# EAGLE schematic pCog102_Wifi_PSPJoy_BLED_TFT (EAGLE 6.6.0)

## Sheet 1 of 4
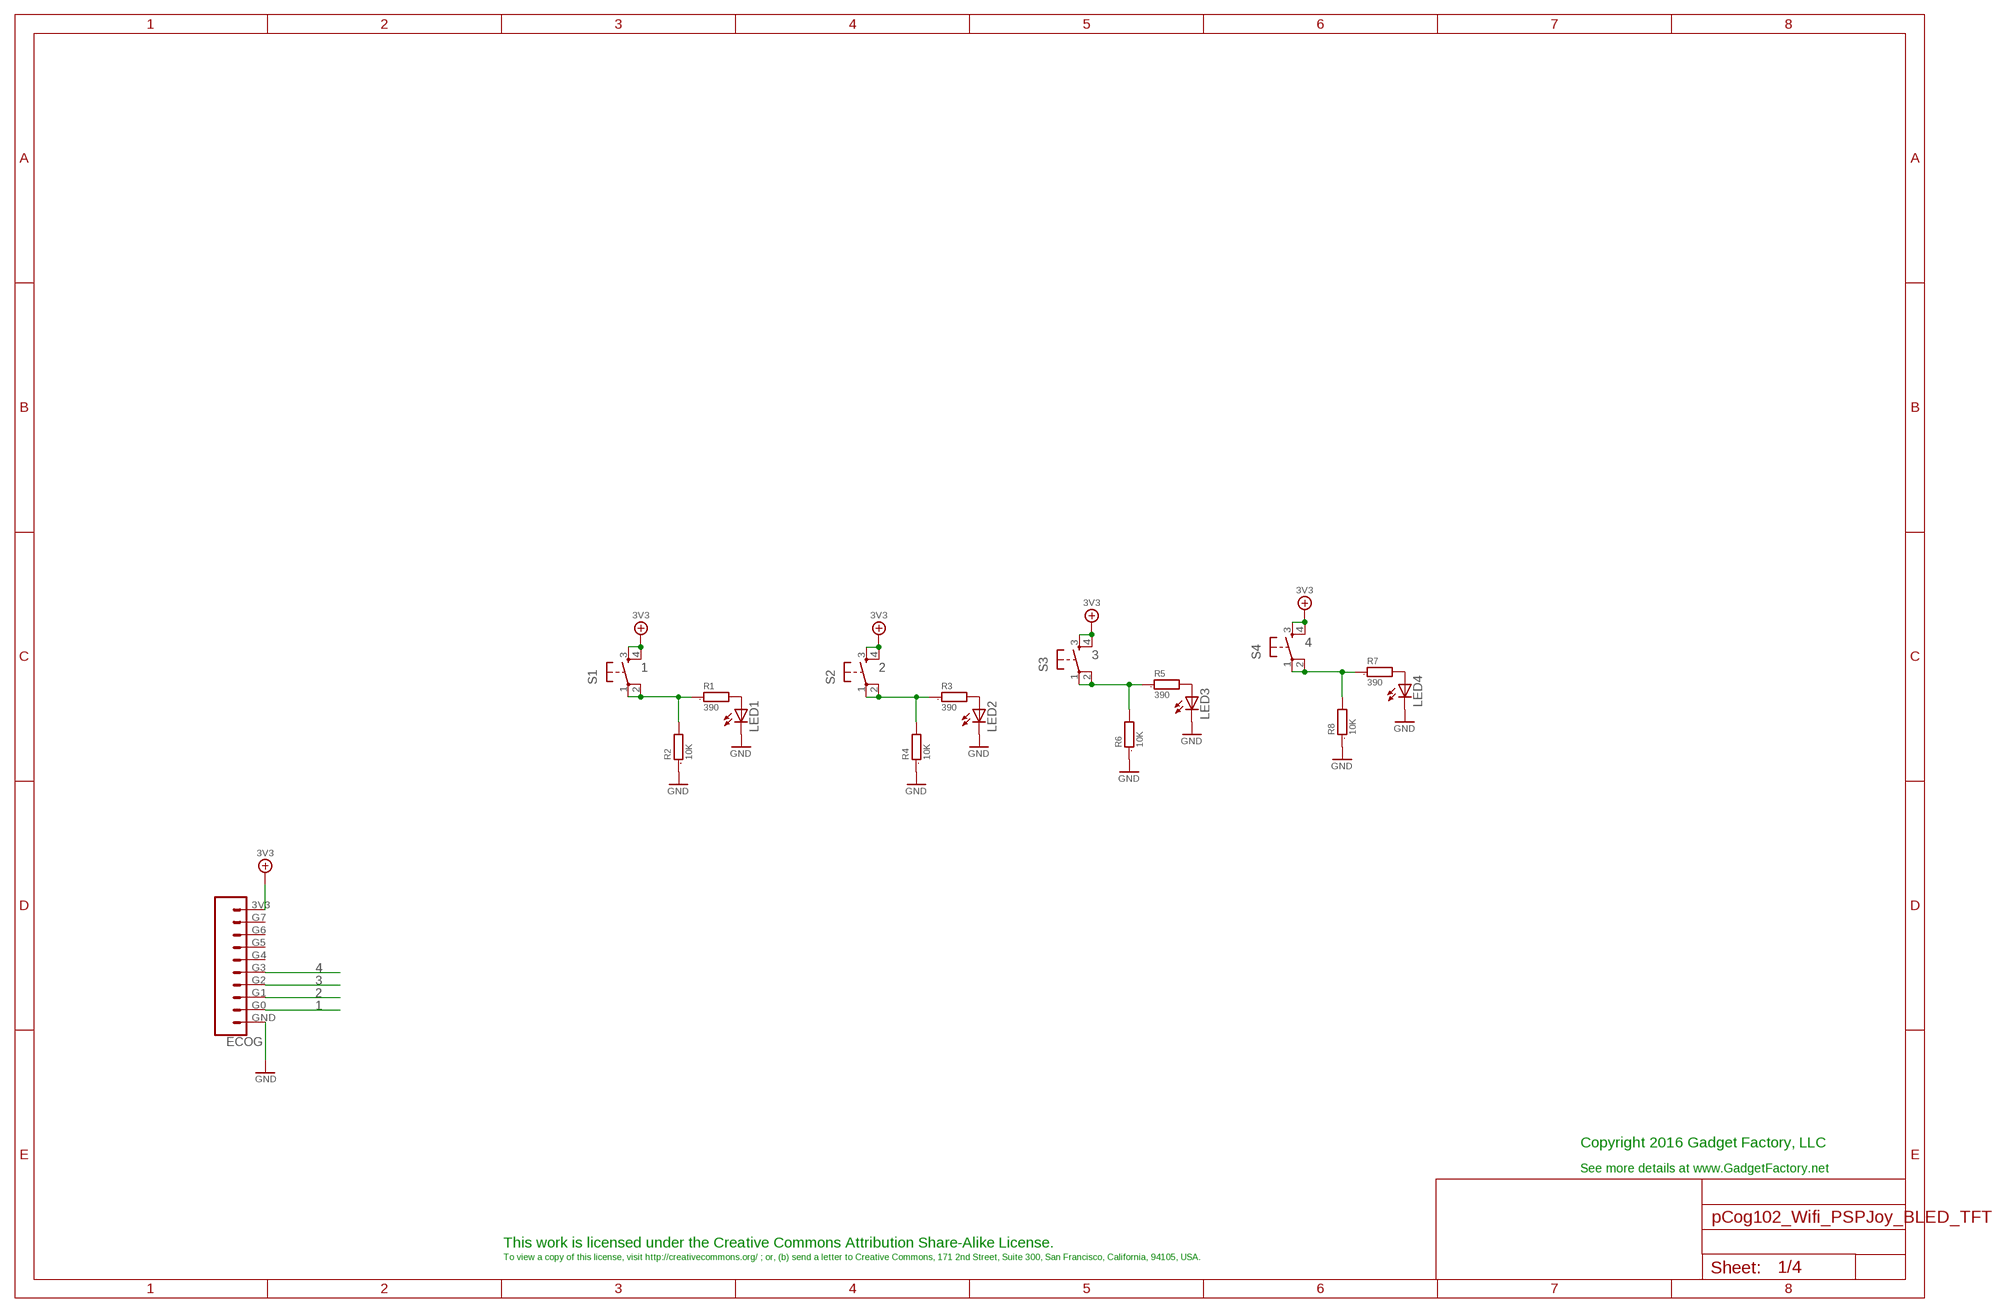
[diagram p0: schematic, sheet 1]

### Parts
ECOG  ECOG_GENERAL_ROWECOG_GENERAL_SMD  [ECOG_GENERAL_SMD]
LED1  LEDCHIP-LED0805  [CHIP-LED0805]
LED2  LEDCHIP-LED0805  [CHIP-LED0805]
LED3  LEDCHIP-LED0805  [CHIP-LED0805]
LED4  LEDCHIP-LED0805  [CHIP-LED0805]
R1  390  R0805  [0805]
R2  10K  R0805  [0805]
R3  390  R0805  [0805]
R4  10K  R0805  [0805]
R5  390  R0805  [0805]
R6  10K  R0805  [0805]
R7  390  R0805  [0805]
R8  10K  R0805  [0805]
S1  TAC_SWITCHPTH  [TACTILE-PTH]
S2  TAC_SWITCHPTH  [TACTILE-PTH]
S3  TAC_SWITCHPTH  [TACTILE-PTH]
S4  TAC_SWITCHPTH  [TACTILE-PTH]

### Nets
1: ECOG.G0 R1.1 R2.2 S1.1 S1.2
2: ECOG.G1 R3.1 R4.2 S2.1 S2.2
3: ECOG.G2 R5.1 R6.2 S3.1 S3.2
3V3: ECOG.3V3 S1.3 S1.4 S2.3 S2.4 S3.3 S3.4 S4.3 S4.4 ; also sheet 2,3,4
4: ECOG.G3 R7.1 R8.2 S4.1 S4.2
GND: ECOG.GND LED1.C LED2.C LED3.C LED4.C R2.1 R4.1 R6.1 R8.1 ; also sheet 2,3,4
N$1: LED1.A R1.2
N$2: LED2.A R3.2
N$3: LED3.A R5.2
N$4: LED4.A R7.2
Unconnected: ECOG.G4 ECOG.G5 ECOG.G6 ECOG.G7

### Notes on the sheet
- Copyright 2016 Gadget Factory, LLC
- See more details at www.GadgetFactory.net
- This work is licensed under the Creative Commons Attribution Share-Alike License.
- To view a copy of this license, visit http://creativecommons.org/ ; or, (b) send a letter to Creative Commons, 171 2nd Street, Suite 300, San Francisco, California, 94105, USA.

## Sheet 2 of 4
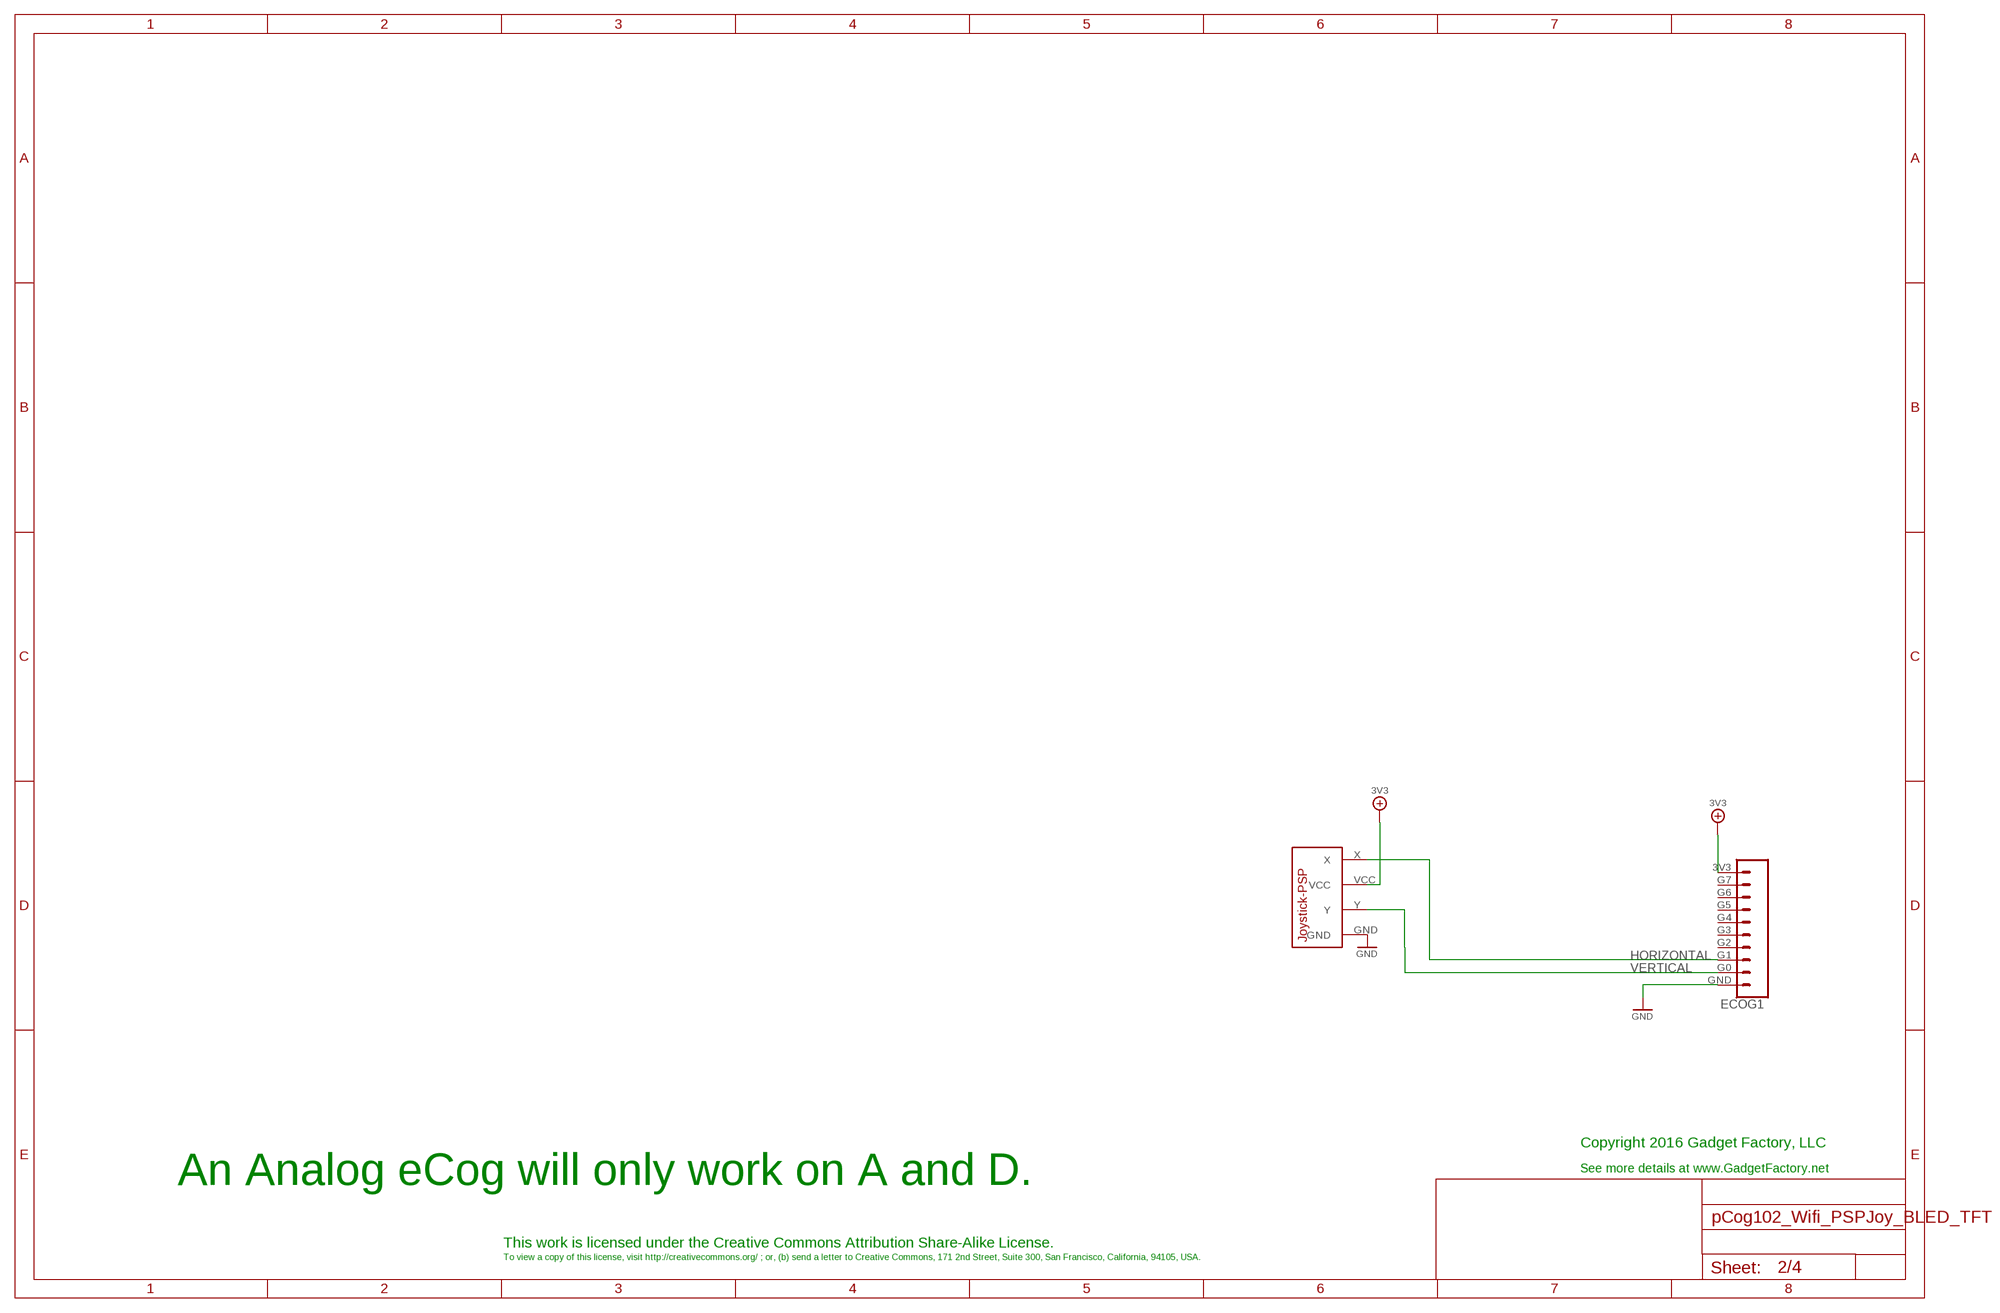
[diagram p1: schematic, sheet 2]

### Parts
ECOG1  ECOG_GENERAL_ROWECOG_GENERAL_SMD  [ECOG_GENERAL_SMD]
U$7  JOYSTICK-PSP1000  [JOYSTICK-PSP1000]

### Nets
3V3: ECOG1.3V3 U$7.VCC ; also sheet 1,3,4
GND: ECOG1.GND U$7.GND ; also sheet 1,3,4
HORIZONTAL: ECOG1.G1 U$7.X
VERTICAL: ECOG1.G0 U$7.Y
Unconnected: ECOG1.G2 ECOG1.G3 ECOG1.G4 ECOG1.G5 ECOG1.G6 ECOG1.G7

### Notes on the sheet
- Copyright 2016 Gadget Factory, LLC
- See more details at www.GadgetFactory.net
- An Analog eCog will only work on A and D.
- This work is licensed under the Creative Commons Attribution Share-Alike License.
- To view a copy of this license, visit http://creativecommons.org/ ; or, (b) send a letter to Creative Commons, 171 2nd Street, Suite 300, San Francisco, California, 94105, USA.

## Sheet 3 of 4
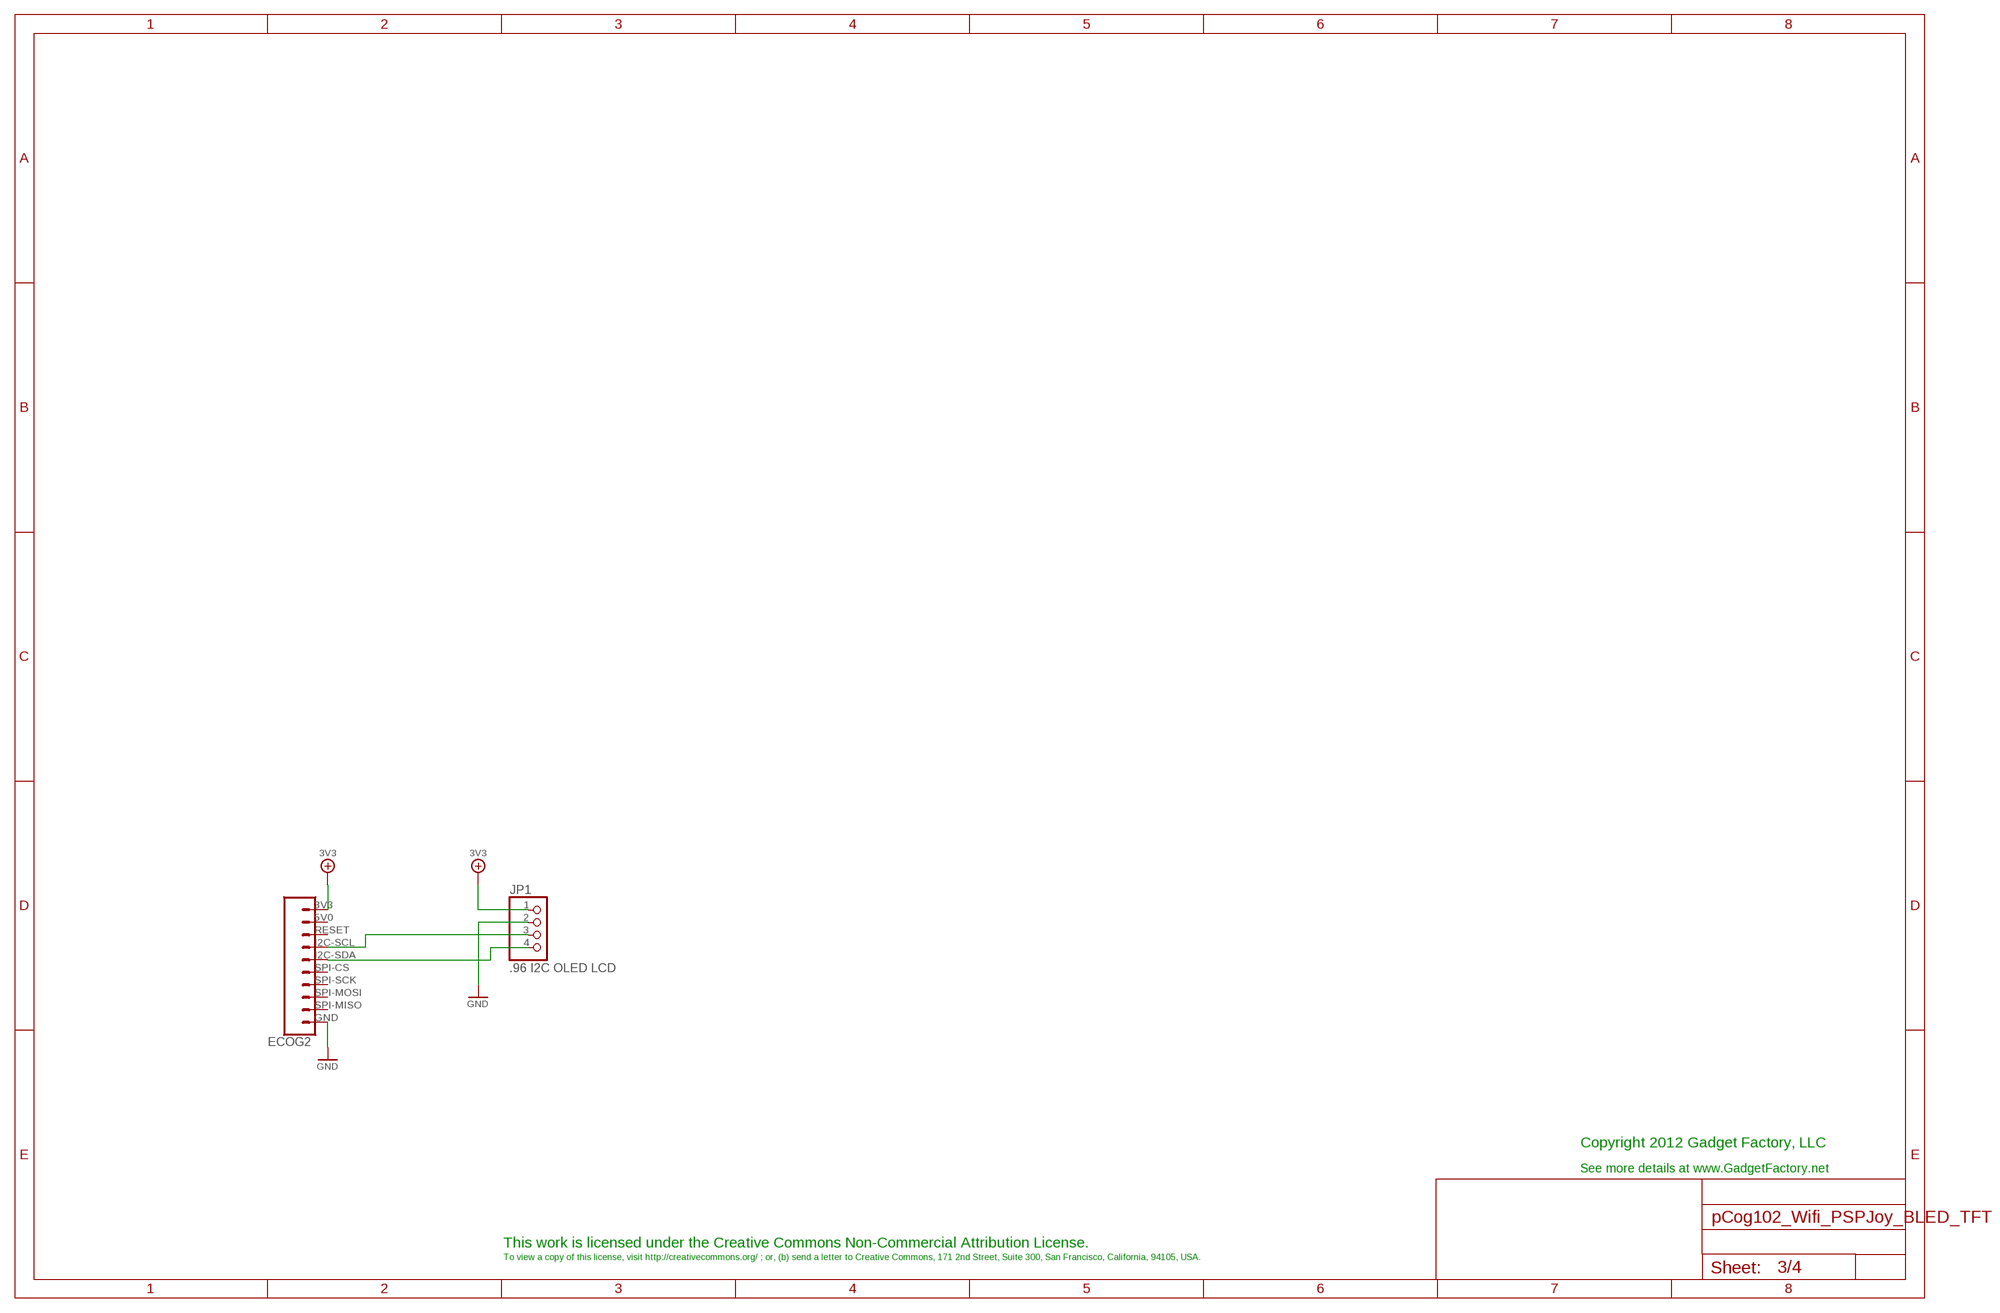
[diagram p2: schematic, sheet 3]

### Parts
ECOG2  ECOG_BUSES_ROWECOG_BUSES_SMD  [ECOG_BUSES_SMD]
JP1  .96 I2C OLED LCD  PINHD-1X4  [1X04]

### Nets
3V3: ECOG2.3V3 JP1.1 ; also sheet 1,2,4
GND: ECOG2.GND JP1.2 ; also sheet 1,2,4
N$7: ECOG2.I2C-SDA JP1.4
N$8: ECOG2.I2C-SCL JP1.3
Unconnected: ECOG2.5V0 ECOG2.RESET ECOG2.SPI-CS ECOG2.SPI-MISO ECOG2.SPI-MOSI ECOG2.SPI-SCK

### Notes on the sheet
- Copyright 2012 Gadget Factory, LLC
- See more details at www.GadgetFactory.net
- This work is licensed under the Creative Commons Non-Commercial Attribution License.
- To view a copy of this license, visit http://creativecommons.org/ ; or, (b) send a letter to Creative Commons, 171 2nd Street, Suite 300, San Francisco, California, 94105, USA.

## Sheet 4 of 4
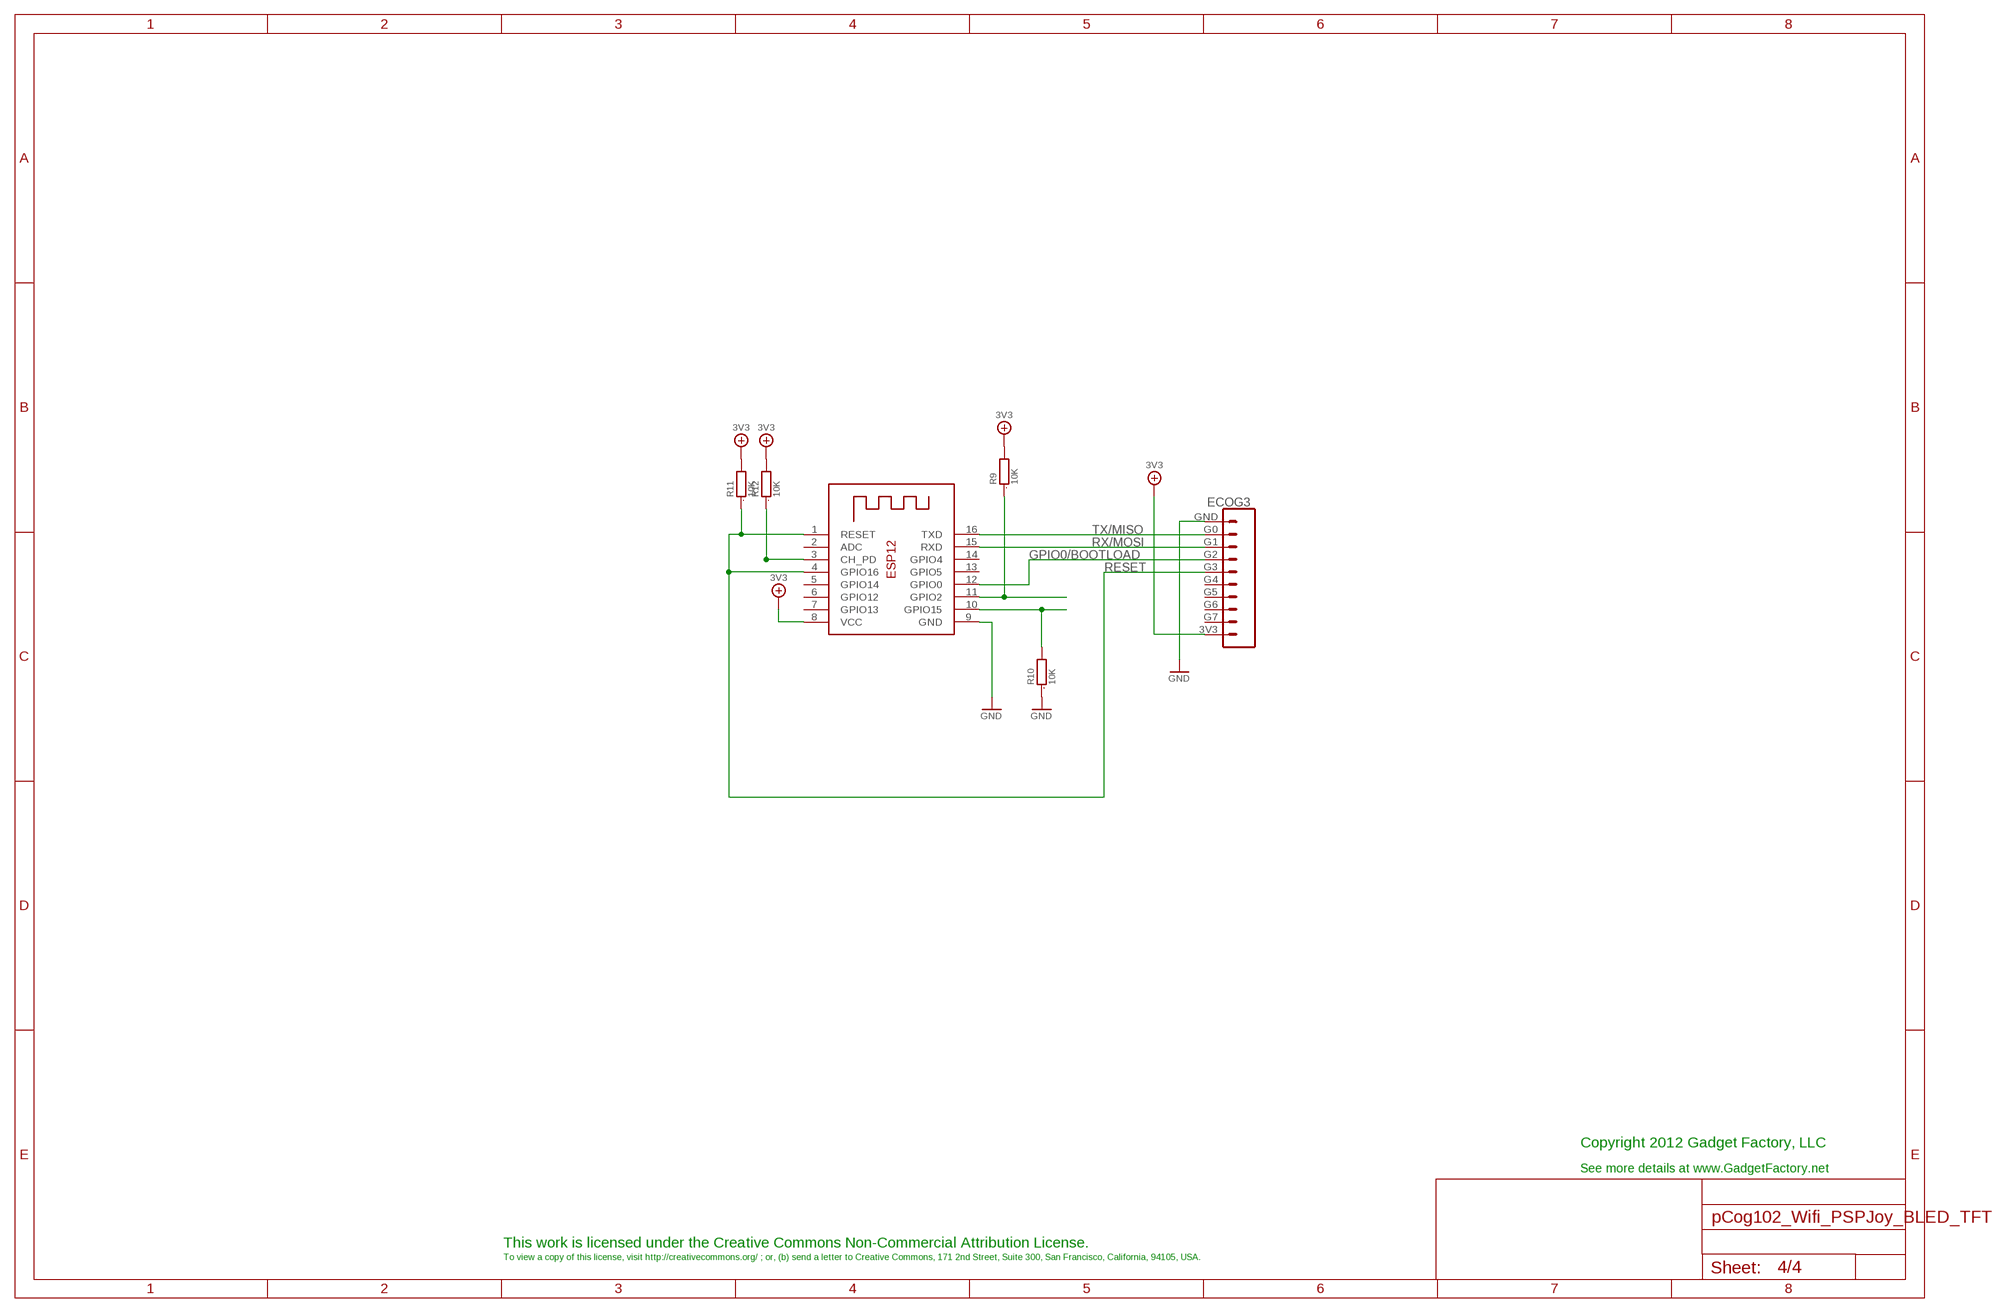
[diagram p3: schematic, sheet 4]

### Parts
ECOG3  ECOG_GENERAL_ROWECOG_GENERAL_SMD  [ECOG_GENERAL_SMD]
R9  10K  R0805  [0805]
R10  10K  R0805  [0805]
R11  10K  R0805  [0805]
R12  10K  R0805  [0805]
X1  ESP-12  [ESP-12]

### Nets
3V3: ECOG3.3V3 R9.2 R11.2 R12.2 X1.8(VCC) ; also sheet 1,2,3
GND: ECOG3.GND R10.1 X1.9(GND) ; also sheet 1,2,3
GPIO0/BOOTLOAD: ECOG3.G2 X1.12(GPIO0)
N$9: R9.1 X1.11(GPIO2)
N$10: R10.2 X1.10(GPIO15)
N$11: R12.1 X1.3(CH_PD)
RESET: ECOG3.G3 R11.1 X1.1(RESET) X1.4(GPIO16)
RX/MOSI: ECOG3.G1 X1.15(RXD)
TX/MISO: ECOG3.G0 X1.16(TXD)
Unconnected: ECOG3.G4 ECOG3.G5 ECOG3.G6 ECOG3.G7 X1.2(ADC) X1.5(GPIO14) X1.6(GPIO12) X1.7(GPIO13) X1.13(GPIO5) X1.14(GPIO4)

### Notes on the sheet
- Copyright 2012 Gadget Factory, LLC
- See more details at www.GadgetFactory.net
- This work is licensed under the Creative Commons Non-Commercial Attribution License.
- To view a copy of this license, visit http://creativecommons.org/ ; or, (b) send a letter to Creative Commons, 171 2nd Street, Suite 300, San Francisco, California, 94105, USA.

## Library data of the parts
ECOG ECOG1 ECOG3 = eCogs:ECOG_GENERAL_ROW; DIGIKEY: S1013EC-10-ND; PARTNO: NREC010SABC-M30RC,SULLINS CONNECTOR SOLUTIONS,dk,S1013EC-10-ND,10 Positions Header Unshrouded Connector 0.100 (2.54mm) Surface Mount Tin eCog, REF78
ECOG2 = eCogs:ECOG_BUSES_ROW; DIGIKEY: S1013EC-10-ND; PARTNO: NREC010SABC-M30RC,SULLINS CONNECTOR SOLUTIONS,dk,S1013EC-10-ND,10 Positions Header Unshrouded Connector 0.100 (2.54mm) Surface Mount Tin eCog, REF78
JP1 = pinhead:PINHD-1X4: PIN HEADER; DEALEXTREME: 419232; PARTNO: 346540,unknown,dx.com,346540,"0.96"" 128*64 I2C Interface White Color OLED Display - http://www.dx.com/p/0-96-128x64-i2c-interface-white-color-oled-display-module-for-arduino-avr-arm-pic-346540", REF93
LED1-LED4 = adafruit:LED: LED OSRAM: - CHIPLED LG R971, LG N971, LY N971, LG Q971, LY Q971, LO R971, LY R971 LH N974, LH R974 LS Q976, LO Q976, LY Q976 LO Q996 - Hyper CHIPLED LW Q18S LB Q993, LB Q99A, LB R99A - SideLED LS A670, LO A670, LY A670, LG A670, LP A670 LB A673, LV A673, LT A673, LW A673 LH A674 LY A675 LS A676, LA A676, LO A676, LY A676, LW A676 LS A679, LY A679, LG A679 - Hyper Micro SIDELED® LS Y876, LA Y876, LO Y876, LY Y876 LT Y87S - SmartLED LW L88C, LW L88S LB L89C, LB L89S, LG L890 LS L89K, LO L89K, LY L89K LS L896, LA L896, LO L896, LY L896 - TOPLED LS T670, LO T670, LY T670, LG T670, LP T670 LSG T670, LSP T670, LSY T670, LOP T670, LYG T670 LG T671, LOG T671, LSG T671 LB T673, LV T673, LT T673, LW T673 LH T674 LS T676, LA T676, LO T676, LY T676, LB T676, LH T676, LSB T676, LW T676 LB T67C, LV T67C, LT T67C, LS T67K, LO T67K, LY T67K, LW E67C LS E67B, LA E67B, LO E67B, LY E67B, LB E67C, LV E67C, LT E67C LW T67C LS T679, LY T679, LG T679 LS T770, LO T770, LY T770, LG T770, LP T770 LB T773, LV T773, LT T773, LW T773 LH T774 LS E675, LA E675, LY E675, LS T675 LS T776, LA T776, LO T776, LY T776, LB T776 LHGB T686 LT T68C, LB T68C - Hyper Mini TOPLED® LB M676 - Mini TOPLED Santana® LG M470 LS M47K, LO M47K, LY M47K Source: http://www.osram.convergy.de/; DIGIKEY: 475-1410-2-ND; PARTNO: LTST-C170KGKT,LITE-ON INC (VA),DK,160-1414-1-ND,LED GREEN CLEAR 0805 SMD, REF17
R1 R3 R5 R7 = GadgetFactory:R: RESISTOR, European symbol; DIGIKEY: RMCF0805JT390RCT-ND; PARTNO: MCR10EZPJ391,ROHM SEMICONDUCTOR (PASSIVE) (VA),DK,RHM390ARCT-ND,RES 390 OHM 1/8W 5% 0805 SMD, REF16
R2 R4 R6 R8-R12 = GadgetFactory:R: RESISTOR, European symbol; DIGIKEY: RMCF0805JT10K0CT-ND; PARTNO: RMCF0805JT10K0,STACKPOLE ELECTRONICS INC (VA),dk,RMCF0805JT10K0CT-ND,RES SMD 10K OHM 5% 1/8W 0805, REF68
S1-S4 = SparkFun:TAC_SWITCH: Momentary Switch Button commonly used for reset or general input. Spark Fun Electronics SKU : COM-00097; DIGIKEY: 679-2428-ND; PARTNO: MJTP1230,Apem,dk,679-2428-ND,Tactile Switch SPST-NO Top Actuated Through Hole, REF95
U$7 = SparkFun:JOYSTICK-PSP1000: This is a footprint for the PSP-1000 Joystick. 4-pins: X, Y, Vcc and GND; PARTNO: 196776,Sony PSP,dx.com,196776,Sony PSP Analog Joystick - http://www.dx.com/p/repair-parts-replacement-3d-joystick-3d-conductive-rubber-for-psp1000-black-196776, REF101; SPARKFUN: COM-09426
X1 = adafruit:ESP-12; ADAFRUIT: 2491; PARTNO: 385646,AI-Thinker,dx.com,385646,ESP8266 Serial Wi-Fi Wireless Transceiver Module - http://www.dx.com/p/esp-12e-esp8266-serial-wi-fi-wireless-transceiver-module-for-arduino-rpi-built-in-antenna-385646, REF94